# Altium project HardwareGesamt.PrjPcb
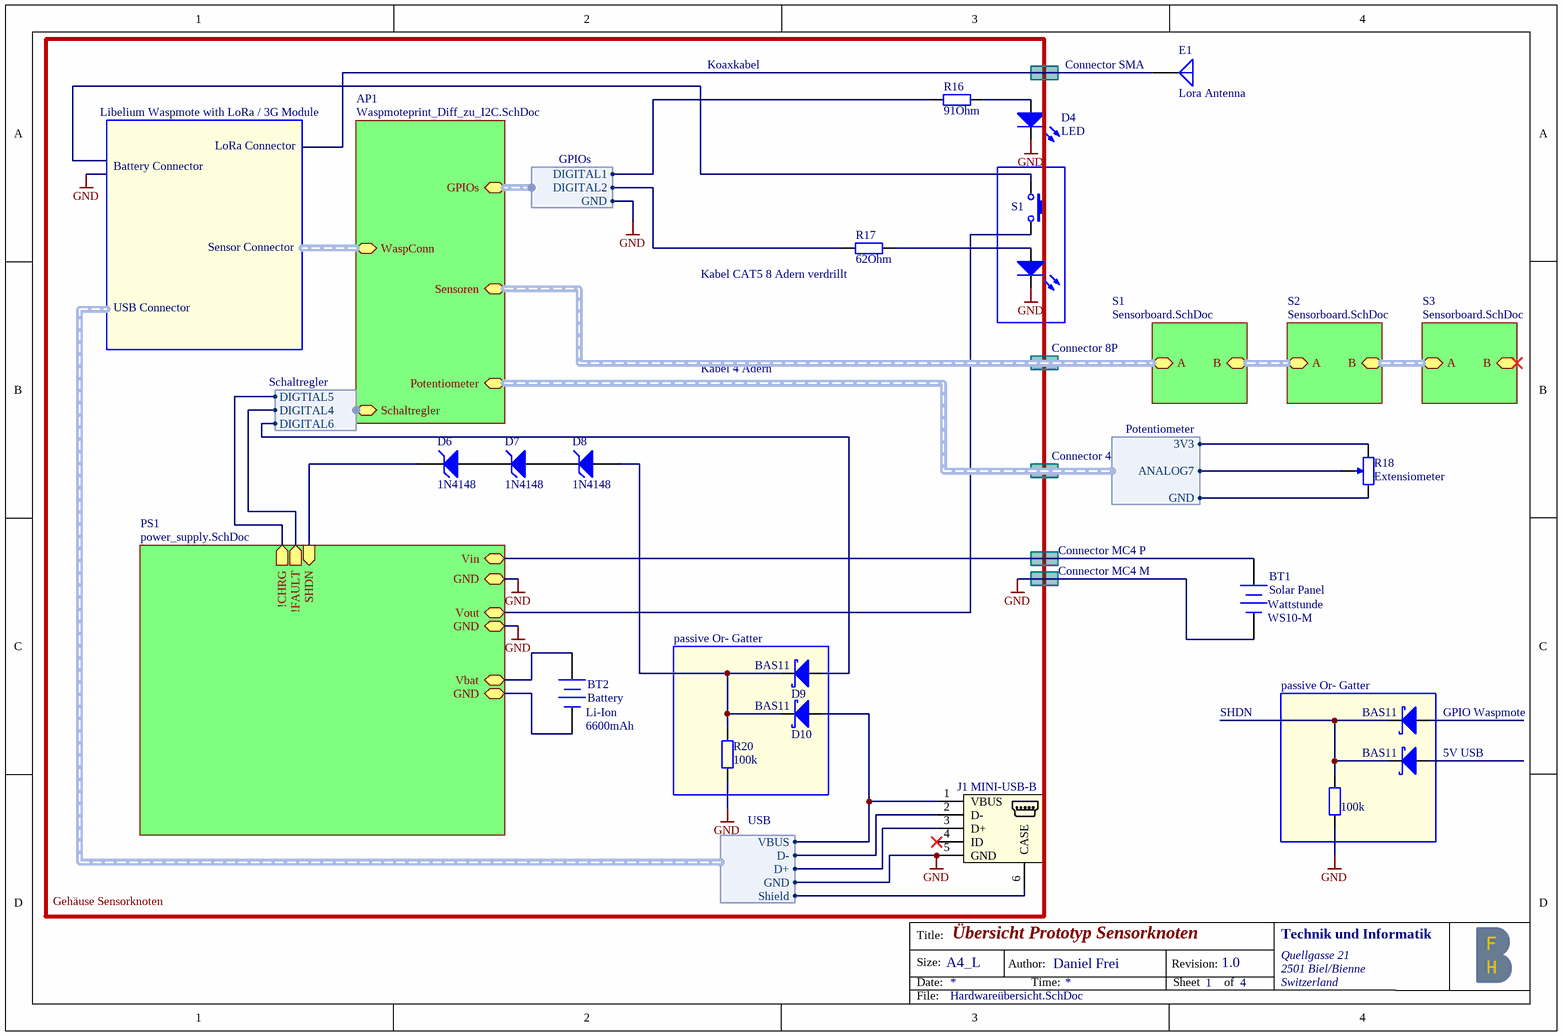
[diagram p0: Hardwareübersicht.SchDoc]
4 sheets, 216 parts. Net scope: hierarchical (ports join the sheet entries above them; power ports are global).
Sheets:
  Hardwareübersicht.SchDoc
    PS1 = power_supply.SchDoc
    AP1 = Waspmoteprint_Diff_zu_I2C.SchDoc
    S1 = Sensorboard.SchDoc
    S2 = Sensorboard.SchDoc
    S3 = Sensorboard.SchDoc

## Sheet Hardwareübersicht.SchDoc: Übersicht Prototyp Sensorknoten
size A4; Author: Daniel Frei; Organization: Technik und Informatik; Address1: Quellgasse 21; Address2: 2501 Biel/Bienne; Address3: Switzerland; Revision: 1.0; SheetNumber: 1; SheetTotal: 4; ProjectName: Rock Monitoring

### Parts
BT1  Solar Panel  value WS10-M  Manufacturer: Wattstunde  [BAT-2]
BT2  Battery  Type: Li-Ion  Nom. Capacity: 6600mAh
D4  LED
D5  LED  (value not drawn)
D6  1N4148
D7  1N4148
D8  1N4148
D9  BAS11
D10  BAS11
D11  BAS11
D12  BAS11
E1  Lora Antenna  [PIN1]
J1  MINI-USB-B
R16  91Ohm  [RESC1005[0402]X35]
R17  62Ohm  [RESC1005[0402]X35]
R18  Extensiometer  [BOURNS3296W]
R20  100k  [RESC1608[0603]X50]
R21  100k  [RESC1608[0603]X50]
S1  Switch  (value not drawn)

### Blocks framed on the sheet
passive Or- Gatter: D9 D10 R20
passive Or- Gatter: D11 D12 R21

### Sub-sheets
AP1 = Waspmoteprint_Diff_zu_I2C.SchDoc: GPIOs (harness GPIOs), Potentiometer (harness Potentiometer), Schaltregler (harness Schaltregler), Sensoren (harness Sensoren), WaspConn (harness WaspmoteConnector)
PS1 = power_supply.SchDoc: SHDN (in), !CHRG (out), !FAULT (out), Vin (bidir), GND (bidir), GND (bidir), Vout (bidir), GND (bidir), Vbat (bidir)
S1 = Sensorboard.SchDoc: A (harness Sensoren), B (harness Sensoren)
S2 = Sensorboard.SchDoc: A (harness Sensoren), B (harness Sensoren)
S3 = Sensorboard.SchDoc: A (harness Sensoren), B (harness Sensoren)

### Harnesses
USB: VBUS, D-, D+, GND, Shield
Potentiometer: 3V3, ANALOG7, GND
Schaltregler: DIGITAL6, DIGITAL4, DIGTIAL5
GPIOs: DIGITAL1, DIGITAL2, GND

### Nets
3V3: R18.3(CW) ; sheet AP1/Potentiometer.3V3
GND: BT1.2(-) BT2.2(-) D4.2(K) D5.2(K) J1.5(GND) R18.1(CCW) R20.1 R21.1 ; sheet PS1/GND, sheet PS1/GND, sheet PS1/GND, harness USB.GND, sheet AP1/Potentiometer.GND, sheet AP1/GPIOs.GND
Vin: BT1.1(+) ; sheet PS1/Vin
Analog7: R18.2(Wiper) ; sheet AP1/Potentiometer.ANALOG7
Digital1: R16.1 ; sheet AP1/GPIOs.DIGITAL1
Digital2: R17.1 ; sheet AP1/GPIOs.DIGITAL2
Digital4: sheet PS1/!FAULT, sheet AP1/Schaltregler.DIGITAL4
Digital5: sheet PS1/!CHRG, sheet AP1/Schaltregler.DIGTIAL5
Digital6: D9.2(A) ; sheet AP1/Schaltregler.DIGITAL6
NetBT2_1: BT2.1(+) S1.1 ; sheet PS1/Vout, sheet PS1/Vbat
NetD4_1: D4.1(A) R16.2
NetD5_1: D5.1(A) R17.2
NetD6_1: D6.1(A) D7.2(K)
NetD6_2: D6.2(K) ; sheet PS1/SHDN
NetD7_1: D7.1(A) D8.2(K)
NetD8_1: D8.1(A) D9.1(K) D10.1(K) R20.2
NetD10_2: D10.2(A) J1.1(VBUS) ; harness USB.VBUS
NetD11_1: D11.1(K) D12.1(K) R21.2
NetJ1_2: J1.2(D-) ; harness USB.D-
NetJ1_3: J1.3(D+) ; harness USB.D+
NetJ1_6: J1.6(CASE) ; harness USB.Shield

Not connected (* = marked no-connect by the designer): D11 2(A); D12 2(A); E1 1(A); J1 4(ID)*; S1 2

### Buses and harness runs
harness sheet AP1/Sensoren = sheet S1/A
harness sheet S1/B = sheet S2/A
harness sheet S2/B = sheet S3/A

### Notes on the sheet
- Libelium Waspmote with LoRa / 3G Module
- Koaxkabel
- Connector SMA
- Battery Connector
- LoRa Connector
- Sensor Connector
- USB Connector
- (near R17) Kabel CAT5 8 Adern verdrillt
- Kabel 4 Adern
- Connector 8P
- Connector 4P
- Connector MC4 P
- Connector MC4 M
- SHDN
- (near D11) GPIO Waspmote
- 5V USB
- Gehäuse Sensorknoten
- Title:
- Size:
- Date:
- A4_L
- Author:
- Time:
- Revision:
- Sheet
- of
- File:

### Library data of the parts
BT1 = Battery: Multicell Battery
BT2 = Battery: Nom. Voltage: 3.7V; Value: ICR18650H-1S3P
D4 = LED: Light Emitting Diode; Manufacturer: Dialight; Manufacturer Part. Nr.: 6071212310F; Color: green
D5 = LED: Light Emitting Diode; Color: green
D6-D8 = D Zener: Zener Diode
D9-D12 = D_SCHOTTKY: Schottky Diode; Value: BAS11
E1 = Antenna: Generic Antenna; Published: 24-Mar-1999; LatestRevisionDate: 17-Jul-2002; LatestRevisionNote: Re-released for DXP Platform.; PackageReference: PIN1; Publisher: Altium Limited
J1 = TYCO_1734035_1: Mini USB B Connector; Manufacturer Part. Nr.: 17-250021; Manufacturer: Conec
R16 R17 = R: Resistor; Modified_by: BEP1; Modified: 10.2008
R18 = POT2: Variable Resistor
R20 R21 = R: Resistor THT
S1 = SW_SPST_PB: Switch with Led; Manufacturer Part. Nr.: RP8200B2M1CEBLKBLKRED; Manufacturer: E-Switch

## Sheet power_supply.SchDoc: PowerSupply_Waspmote
size A4; Organization: Altium Limited; Address1: L3, 12a Rodborough Rd; Address2: Frenchs Forest; Address3: NSW; Address4: Australia 2086
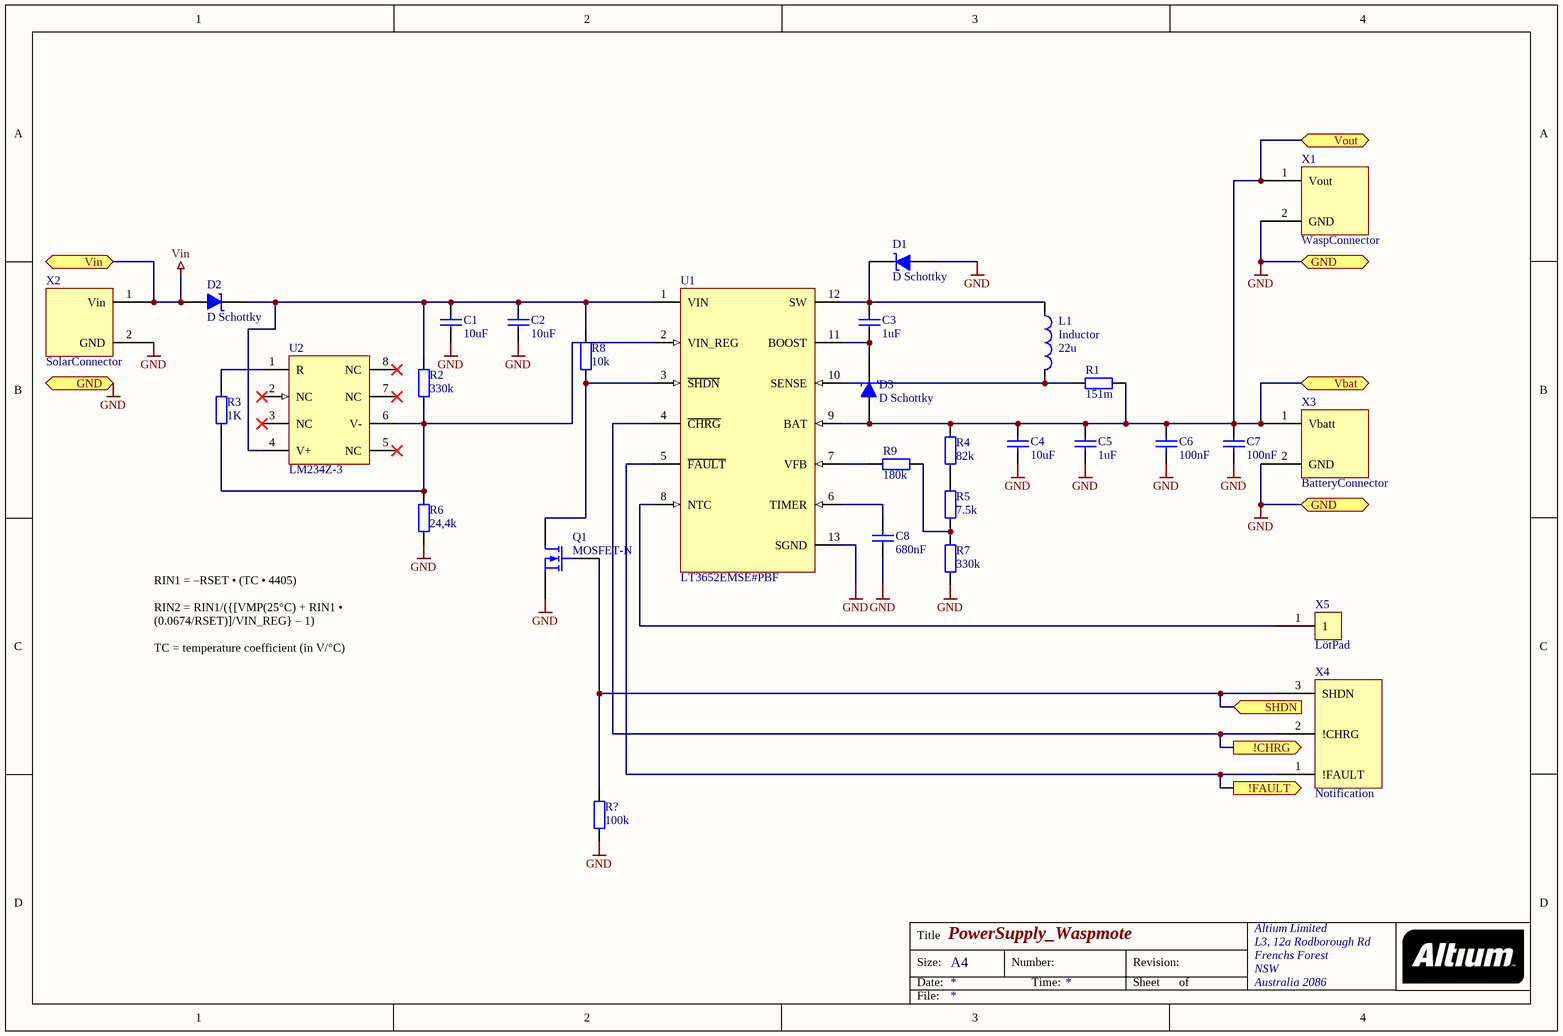
[diagram p1: power_supply.SchDoc]

### Parts
(Parts that share a designator on the sheet are numbered #1, #2 ... from top to bottom, then left to right.)
C1#1  10uF  [C1210]
C2#1  10uF  [C1210]
C3#1  1uF  [C1210]
C4#1  10uF  [C1210]
C5#1  1uF  [C1210]
C6#1  100nF  [0402]
C7#1  100nF  [0402]
C8#1  680nF  [0402]
D1  D Schottky  [SMB]
D2  D Schottky  [SMB]
D3  D Schottky  [SMB]
L1  Inductor  value 22u  [LMX131J]
Q1  MOSFET-N  [Sot-23]
R1#1  151m  [2510]
R2#1  330k  [0603]
R3#1  1K  [0603]
R4#1  82k  [0603]
R5#1  7.5k  [0603]
R6#1  24,4k  [0603]
R7#1  330k  [0402]
R8#1  10k  [0603]
R9#1  180k  [0402]
R?  100k  [RESC1608[0603]X50]
U1#1  LT3652EMSE#PBF  [LT-MSE-12-EDP_N]
U2  LM234Z-3  [SO-8]
X1#1  WaspConnector  [Wasp_Connector]
X2  SolarConnector  [Solar_Connector]
X3#1  BatteryConnector  [Battery_Connector]
X4#1  Notification  [NOTIFICATION_CONNECTOR]
X5#1  LötPad  [LötPad]

### Ports
!CHRG (out), !FAULT (out), GND (bidir), SHDN (in), Vbat (bidir), Vin (bidir), Vout (bidir)

### Nets
GND: C1#1.1 C2#1.1 C4#1.1 C5#1.1 C6#1.1 C7#1.1 C8#1.1 D1.1(A) Q1.3(S) R6#1.1 R7#1.1 R?.1 U1#1.13(SGND) X1#1.2(GND) X2.2(GND) X3#1.2(GND) ; port GND
Vin: D2.1(A) X2.1(Vin) ; port Vin
Digital4: U1#1.5(~{FAULT}) X4#1.1(!FAULT) ; port !FAULT
Digital5: U1#1.4(~{CHRG}) X4#1.2(!CHRG) ; port !CHRG
NetBT2_1: C4#1.2 C5#1.2 C6#1.2 C7#1.2 D3.1(A) R1#1.1 R4#1.2 U1#1.9(BAT) X1#1.1(Vout) X3#1.1(Vbatt) ; port Vout, port Vbat
NetC1#1_2: C1#1.2 C2#1.2 D2.2(K) R2#1.2 R8#1.2 U1#1.1(VIN) U2.4(V+)
NetC3#1_1: C3#1.1 D3.2(K) U1#1.11(BOOST)
NetC3#1_2: C3#1.2 D1.2(K) L1.1 U1#1.12(SW)
NetC8#1_2: C8#1.2 U1#1.6(TIMER)
NetD6_2: Q1.2(G) R?.2 X4#1.3(SHDN) ; port SHDN
NetL1_2: L1.2 R1#1.2 U1#1.10(SENSE)
NetQ1_1: Q1.1(D) R8#1.1 U1#1.3(~{SHDN})
NetR2#1_1: R2#1.1 R3#1.1 R6#1.2 U1#1.2(VIN_REG) U2.6(V-)
NetR3#1_2: R3#1.2 U2.1(R)
NetR4#1_1: R4#1.1 R5#1.2
NetR5#1_1: R5#1.1 R7#1.2 R9#1.1
NetR9#1_2: R9#1.2 U1#1.7(VFB)
NetU1#1_8: U1#1.8(NTC) X5#1.1

Not connected (* = marked no-connect by the designer): U2 2(NC)* 3(NC)* 5(NC)* 7(NC)* 8(NC)*

### Notes on the sheet
- RIN1 = –RSET • (TC • 4405)
  RIN2 = RIN1/({[VMP(25°C) + RIN1 • (0.0674/RSET)]/VIN_REG} – 1)
  TC = temperature coefficient (in V/°C)
- Title
- Size:
- Date:
- A4
- Number:
- Time:
- Revision:
- Sheet
- of
- File:

### Library data of the parts
C1#1 C2#1 C3#1 C4#1 C5#1 C6#1 C7#1 C8#1 = Cap Semi: Capacitor; Published: 8-Jun-2000; LatestRevisionDate: 29-May-2009; LatestRevisionNote: IPC-7351 Footprint Added.; PackageReference: C1206; Publisher: Altium Limited; PackageDescription: Chip Capacitor
  C1#1 C2#1 C4#1: Value: 10uF; Supplier 1: Farnell; Supplier 2: Digi-Key; Supplier Part Number 1: 1828859; Supplier Part Number 2: 490-1891-1-ND
  C3#1 C5#1: Value: 1uF; Supplier 1: Farnell; Supplier 2: Digi-Key; Supplier Part Number 2: 1276-3352-1-ND
  C6#1 C7#1: Value: 100nF; Supplier 1: Farnell; Supplier 2: Digi-Key; Supplier Part Number 1: 1844578; Supplier Part Number 2: 490-5920-1-ND
  C8#1: Value: 680nF
D1-D3 = D Schottky: Schottky Diode; Published: 8-Jun-2000; LatestRevisionDate: 17-Jul-2002; LatestRevisionNote: Re-released for DXP Platform.; PackageReference: SMB; Publisher: Altium Limited; PackageDescription: DO-214-AA/SMB; 2 C-Bend Leads; Body 5.3 x 3.6 mm, inc. leads (LxW); Code_JEDEC: DO-214-AA; Supplier Part Number 2: B340LB-FDICT-ND; Supplier 2: Digi-Key; Supplier Part Number 1: 1843684; Supplier 1: Farnell
Q1 = MOSFET-N: N-Channel MOSFET; Published: 8-Jun-2000; LatestRevisionDate: 17-Jul-2002; LatestRevisionNote: Re-released for DXP Platform.; PackageVersion: 1995/1996; PackageReference: E3; Publisher: Altium Limited; PackageDescription: TO, Flat Index; 3 In-Line, Axial Leads; Body Dia. 4.6mm; Lead Dia. 0.5 mm (max); Supplier Part Number 2: FDV301NCT-ND; Supplier 2: Digi-Key; Supplier 1: Farnell; Supplier Part Number 1: 9845011
R1#1 R2#1 R3#1 R4#1 R5#1 R6#1 R7#1 R8#1 R9#1 = Res2: Resistor; Published: 8-Jun-2000; LatestRevisionDate: 17-Jul-2002; LatestRevisionNote: Re-released for DXP Platform.; PackageReference: AXIAL-0.4; Publisher: Altium Limited; PackageDescription: Axial Device, Thru-Hole; 2 Leads; 0.4 in Pin Spacing
  R1#1: Value: 151m; Supplier 2: Digi-Key; Supplier Part Number 2: WSLG-.151CT-ND
  R2#1: Value: 330k
  R3#1: Value: 1K
  R4#1: Value: 82k; Supplier 2: Digi-Key; Supplier Part Number 2: 311-316KHRCT-ND; Supplier 1: Farnell; Supplier Part Number 1: 2303268
  R5#1: Value: 7.5k; Supplier Part Number 1: 2059603; Supplier 1: Farnell; Supplier 2: Digi-Key; Supplier Part Number 2: 311-1.2KGRCT-ND
  R6#1: Value: 24,4k
  R7#1: Value: 330k; Supplier 1: Farnell; Supplier 2: Digi-Key; Supplier Part NUmber 2: 541-1.18MLCT-ND; Supplier Part Number 1: 2316670
  R8#1: Value: 10k; Supplier 1: Farnell; Supplier 2: Digi-Key; Supplier Part NUmber 2: 311-10KGRCT-ND; Supplier Part Number 1: 1795343
  R9#1: Value: 180k; Supplier Part Number 2: 311-3.0JRCT-ND; Supplier 2: Digi-Key; Supplier 1: Farnell
R? = R: Resistor THT
U1#1 = LT3652EMSE#PBF: Battery Charger for Solar Power; Manufacturer: Linear Technology; Number of Outputs: 1; Vin Max(V): 32; Vin Min(V): 4.95; DatasheetVersion: Rev. D; PackageVersion: Rev. G, 05/2013; PackageReference: MSE-12-EDP; PackageDescription: 12-Pin Plastic MSOP, Exposed Die Pad, Body 4.039 x 3 mm, Pitch 0.65 mm; Supplier 1: Farnell; Supplier Part Number 1: 1839126; Supplier 2: Digi-Key; Supplier Part Number 2: LT3652EMSE#PBF-ND; Energy Source: Solar; RoHS: TRUE; Topology: Battery Charger; Mounting Technology: Surface Mount; PartNumber: LT3652EMSE#PBF; ComponentLink1Description: Manufacturer URL; ComponentLink1URL: http://www.linear.com/; ComponentLink2Description: Datasheet; ComponentLink2URL: http://cds.linear.com/docs/en/datasheet/3652fd.pdf; ComponentLink3Description: Package Specification; ComponentLink3URL: http://cds.linear.com/docs/en/packaging/05081666_G_MSE12.pdf; Value: LT3652EMSE#PBF
U2 = LM234Z-3: 3-Terminal Adjustable Current Source, 3-pin TO-92; Manufacturer: National Semiconductor; PackageTopMarking: NSXYTT*LM234*Z-3; PowerWise: N; CompType: MiscPower; High-Reliability: Y; DatasheetVersion: Mar-2005; PackageVersion: revG, Sep-2000; PackageReference: Z03A; PackageDescription: TO-92, Molded, 3 Lead; PartNumber: LM234Z-3; RoHS: N; PinCount: 3; Code_JEDEC: TO-226-AA; ComponentLink1Description: Manufacturer URL; ComponentLink1URL: http://www.national.com/; ComponentLink2Description: LM234 Datasheet; ComponentLink2URL: http://www.national.com/ds/LM/LM234.pdf; ComponentLink3Description: LM234 Web Page; ComponentLink3URL: http://www.national.com/pf/LM/LM234.html; ComponentLink4Description: Z03A Package Page; ComponentLink4URL: http://www.national.com/packaging/folders/z03a.html; Supplier part Number 1: 1467822; Supplier 1: Farnell; Supplier 2: Digikey; Supplier Part Number 2: 497-1549-1-ND; Value: LM234Z-3
X1#1 = WaspConnector: Connector; Supplier 1: Farnell; Supplier Part Number 1: 3705262; Supplier 2: Digi-Key; Supplier Part Number 2: 277-1150-ND
X2 = SolarConnector: Connector; Supplier Part Number 1: 3705262; Supplier Part Number 2: 277-1150-ND; Supplier 1: Farnell; Supplier 2: Digi-Key
X3#1 = BatteryConnector: Connector; Supplier 1: Farnell; Supplier 2: Digi-Key; Supplier Part Number 1: 3705262; Supplier Part Number 2: 277-1150-ND
X4#1 = Notification: Connector; Supplier 1: Farnell; Supplier 2: Digi-Key; Supplier Part Number 1: 3705274; Supplier Part Number 2: 277-1151-ND
X5#1 = LötPad: PAD
L1 = Inductor: Supplier 1: Farnell; Supplier 2: Digi-Key; Supplier Part Number 2: 478-7123-1-ND; Supplier Part Number 1: 2373880

## Sheet Waspmoteprint_Diff_zu_I2C.SchDoc: Übergangsprint Waspmote- rest. Hardware
size A4; Organization: Berner Fachhochschule; Address1: Technik und Informatik; Address2: Quellgasse 21; Address3: CH-2500 Biel/Bienne; Address4: Switzerland; Revision: 0.1; SheetNumber: 1; SheetTotal: 1; Date: 11.05.2016; Author: Daniel Frei; DrawnBy: Daniel Frei; ProjectName: Rock Monitoring
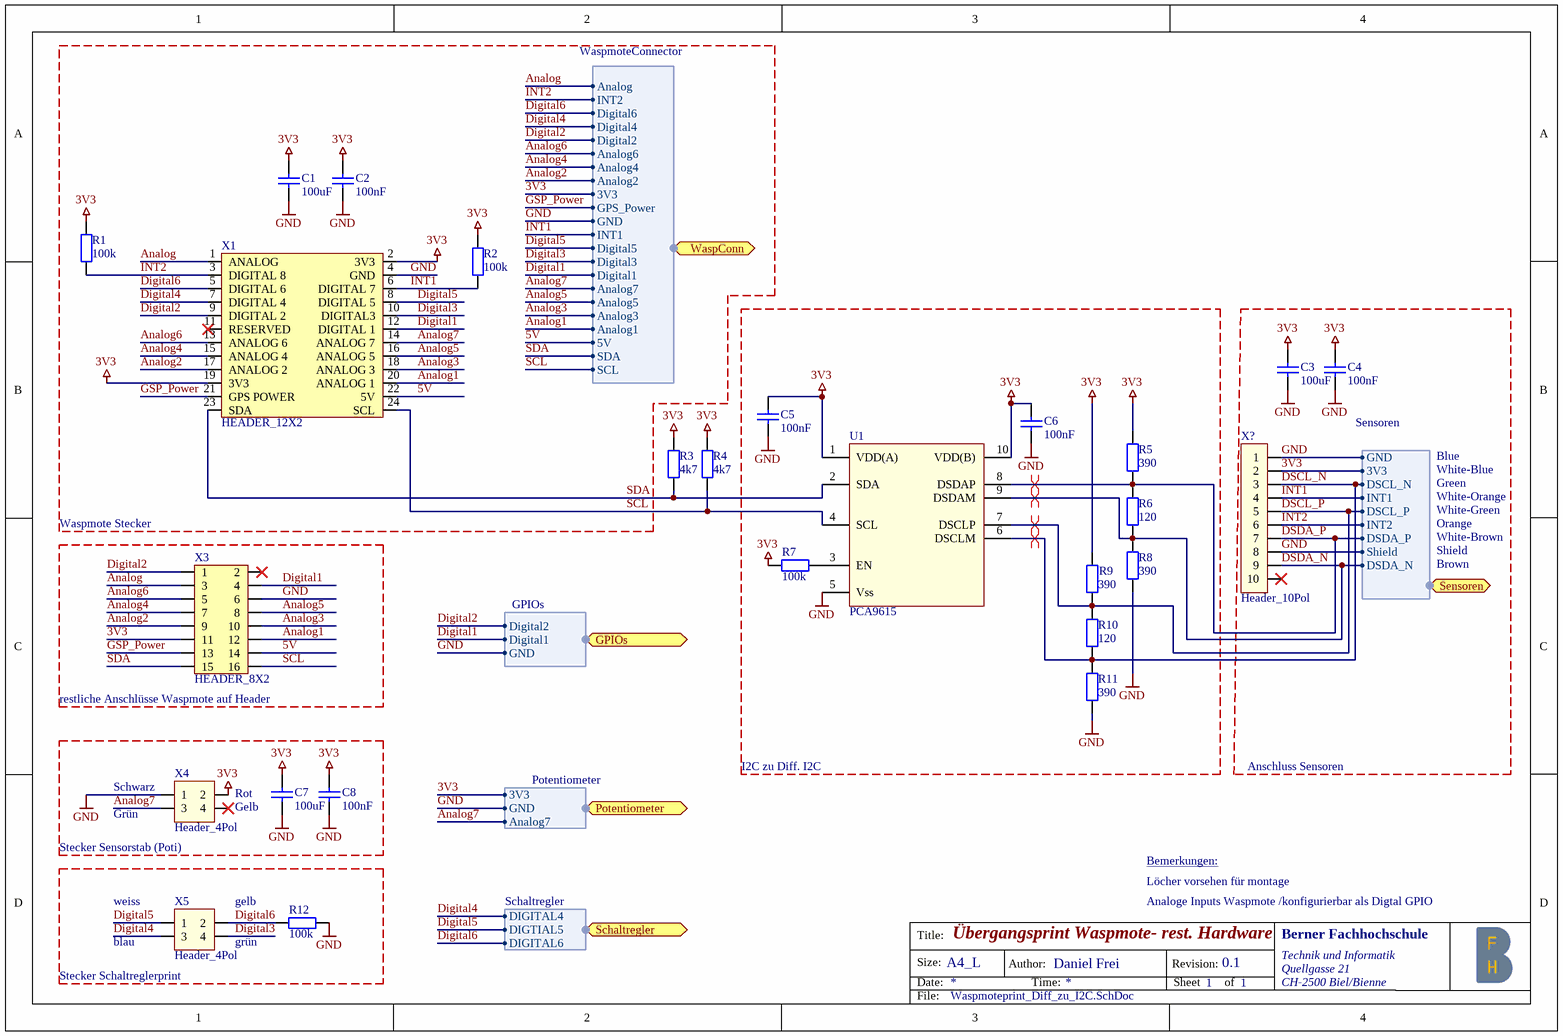
[diagram p2: Waspmoteprint_Diff_zu_I2C.SchDoc]

### Parts
(Parts that share a designator on the sheet are numbered #1, #2 ... from top to bottom, then left to right.)
C1#2  100uF  [CAPC3225[1210]X120]
C2#2  100nF  [CAPC1005[0402]X50]
C3#2  100uF  [CAPC3225[1210]X120]
C4#2  100nF  [CAPC1005[0402]X50]
C5#2  100nF  [CAPC1005[0402]X50]
C6#2  100nF  [CAPC1005[0402]X50]
C7#2  100uF  [CAPC3225[1210]X120]
C8#2  100nF  [CAPC1005[0402]X50]
R1#2  100k  [RESC1005[0402]X35]
R2#2  100k  [RESC1005[0402]X35]
R3#2  4k7  [RESC1005[0402]X35]
R4#2  4k7  [RESC1005[0402]X35]
R5#2  390  [RESC1005[0402]X35]
R6#2  120  [RESC1005[0402]X35]
R7#2  100k  [RESC1005[0402]X35]
R8#2  390  [RESC1005[0402]X35]
R9#2  390  [RESC1005[0402]X35]
R10  120  [RESC1005[0402]X35]
R11  390  [RESC1005[0402]X35]
R12  100k  [RESC1005[0402]X35]
U1#2  PCA9615  [TSSOP10]
X1#2  HEADER_12X2  [HDR2X12_V_M]
X3#2  HEADER_8X2  [HDR2X8_V_M]
X4#2  Header_4Pol  [Header_2mm_4Pol]
X5#2  Header_4Pol  [Header_2mm_4Pol]
X?  Header_10Pol  [Header_2mm_10Pol]

### Blocks framed on the sheet
Waspmote Stecker: C1#2 C2#2 R1#2 R2#2 X1#2
I2C zu Diff. I2C: C5#2 C6#2 R5#2 R6#2 R7#2 R8#2 R9#2 R10 R11 U1#2

### Ports
GPIOs (harness GPIOs), Potentiometer (harness Potentiometer), Schaltregler (harness Schaltregler), Sensoren (harness Sensoren), WaspConn (harness WaspmoteConnector)

### Harnesses
Sensoren: GND, 3V3, DSCL_N, INT1, DSCL_P, INT2, DSDA_P, Shield, DSDA_N
GPIOs: Digital2, Digital1, GND
Potentiometer: Analog7, GND, 3V3
WaspmoteConnector: Analog, INT2, Digital6, Digital4, Digital2, Analog6, Analog4, Analog2, 3V3, GPS_Power, GND, INT1, Digital5, Digital3, Digital1, Analog7, Analog5, Analog3, Analog1, 5V, SDA, SCL
Schaltregler: DIGITAL4, DIGITAL6, DIGTIAL5

### Nets
3V3: C1#2.2 C2#2.2 C3#2.2 C4#2.2 C5#2.2 C6#2.2 C7#2.2 C8#2.2 R1#2.2 R2#2.2 R3#2.2 R4#2.2 R5#2.2 R7#2.1 R9#2.2 U1#2.1(VDD(A)) U1#2.10(VDD(B)) X1#2.2(3V3) X1#2.19(3V3) X3#2.11 X4#2.2 X?.2 ; port Sensoren.3V3, port Potentiometer.3V3, port WaspConn.3V3
GND: C1#2.1 C2#2.1 C3#2.1 C4#2.1 C5#2.1 C6#2.1 C7#2.1 C8#2.1 R8#2.1 R11.1 R12.1 U1#2.5(Vss) X1#2.4(GND) X3#2.6 X4#2.1 X?.1 X?.8 ; port Sensoren.GND, port Sensoren.Shield, port GPIOs.GND, port Potentiometer.GND, port WaspConn.GND
5V: X1#2.22(5V) X3#2.14 ; port WaspConn.5V
Analog: X1#2.1(ANALOG) X3#2.3 ; port WaspConn.Analog
Analog1: X1#2.20(ANALOG_1) X3#2.12 ; port WaspConn.Analog1
Analog2: X1#2.17(ANALOG_2) X3#2.9 ; port WaspConn.Analog2
Analog3: X1#2.18(ANALOG_3) X3#2.10 ; port WaspConn.Analog3
Analog4: X1#2.15(ANALOG_4) X3#2.7 ; port WaspConn.Analog4
Analog5: X1#2.16(ANALOG_5) X3#2.8 ; port WaspConn.Analog5
Analog6: X1#2.13(ANALOG_6) X3#2.5 ; port WaspConn.Analog6
Analog7: X1#2.14(ANALOG_7) X4#2.3 ; port Potentiometer.Analog7, port WaspConn.Analog7
Digital1: X1#2.12(DIGITAL_1) X3#2.4 ; port GPIOs.Digital1, port WaspConn.Digital1
Digital2: X1#2.9(DIGITAL_2) X3#2.1 ; port GPIOs.Digital2, port WaspConn.Digital2
Digital3: X1#2.10(DIGITAL3) X5#2.4 ; port WaspConn.Digital3
Digital4: X1#2.7(DIGITAL_4) X5#2.3 ; port WaspConn.Digital4, port Schaltregler.DIGITAL4
Digital5: X1#2.8(DIGITAL_5) X5#2.1 ; port WaspConn.Digital5, port Schaltregler.DIGTIAL5
Digital6: R12.2 X1#2.5(DIGITAL_6) X5#2.2 ; port WaspConn.Digital6, port Schaltregler.DIGITAL6
DSCL_N: R10.1 R11.2 U1#2.6(DSCLM) X?.3 ; port Sensoren.DSCL_N
DSCL_P: R9#2.1 R10.2 U1#2.7(DSCLP) X?.5 ; port Sensoren.DSCL_P
DSDA_N: R6#2.1 R8#2.2 U1#2.9(DSDAM) X?.9 ; port Sensoren.DSDA_N
DSDA_P: R5#2.1 R6#2.2 U1#2.8(DSDAP) X?.7 ; port Sensoren.DSDA_P
GSP_Power: X1#2.21(GPS_POWER) X3#2.13 ; port WaspConn.GPS_Power
INT1: R2#2.1 X1#2.6(DIGITAL_7) X?.4 ; port Sensoren.INT1, port WaspConn.INT1
INT2: R1#2.1 X1#2.3(DIGITAL_8) X?.6 ; port Sensoren.INT2, port WaspConn.INT2
SCL: R4#2.1 U1#2.4(SCL) X1#2.24(SCL) X3#2.16 ; port WaspConn.SCL
SDA: R3#2.1 U1#2.2(SDA) X1#2.23(SDA) X3#2.15 ; port WaspConn.SDA
NetR7#2_2: R7#2.2 U1#2.3(EN)

Not connected (* = marked no-connect by the designer): X1#2 11(RESERVED)*; X3#2 2*; X4#2 4*; X? 10*

### Layout directives
differential pair: DSCL_N, DSCL_P, DSDA_N, DSDA_P

### Notes on the sheet
- Blue
- White-Blue
- White-Green
- White-Orange
- Green
- Shield
- White-Brown
- Brown
- Orange
- (near X3#2) restliche Anschlüsse Waspmote auf Header
- (near X4#2) Schwarz
- Anschluss Sensoren
- (near X4#2) Stecker Sensorstab (Poti)
- (near X4#2) Grün
- Rot
- Gelb
- (near X5#2) weiss
- gelb
- Analoge Inputs Waspmote /konfigurierbar als Digtal GPIO
- Löcher vorsehen für montage
- Bemerkungen:
- (near X5#2) Stecker Schaltreglerprint
- (near X5#2) blau
- grün
- Title:
- Size:
- Date:
- A4_L
- Author:
- Time:
- Revision:
- Sheet
- of
- File:

### Library data of the parts
C1#2 C3#2 C7#2 = C: Capacitor; Manufacturer: Murata; Manufacturer Part Number: GRM32ER61A107ME20L; Modified_by: BEP1; Modified: 10.2008; Type: *; Voltage: *; Value: 100uF; Supplier 1: Digi-Key; Supplier 2: Mouser; Supplier Part Number 1: 490-9969-1-ND; Supplier Part Number 2: 81-GRM32ER61A107ME0L
C2#2 C4#2 C5#2 C6#2 C8#2 = C: Capacitor; Modified_by: BEP1; Modified: 10.2008; Type: *; Voltage: *; Value: 100nF
R1#2 R2#2 R3#2 R4#2 R5#2 R6#2 R7#2 R8#2 R9#2 R10-R12 = R: Resistor; Modified_by: BEP1; Modified: 10.2008
  R1#2 R2#2 R7#2 R12: Value: 100k
  R3#2 R4#2: Value: 4k7
  R5#2 R8#2 R9#2 R11: Value: 390
  R6#2 R10: Value: 120
U1#2 = PCA9615: differential I2C-bus buffer; Manufacturer Part Number: PCA9615DPJ; Manufacturer: NXP; Value: PCA9615; Supplier Part Number 2: 771-PCA9615DPJ; Supplier Part Number 1: 568-11484-1-ND; Supplier 1: Digi-Key; Supplier 2: Mouser
X1#2 = HEADER_12X2: Header, 12-Pin, Dual row; Supplier 1: *; Supplier 2: *; Manufacturer: *; Manufacturer Part Number: *; Supplier Part Number 1: *; Supplier Part Number 2: *
X3#2 = HEADER_8X2: Header, 16-Pin, Dual row; Supplier 1: *; Supplier 2: *; Manufacturer: *; Manufacturer Part Number: *; Supplier Part Number 1: *; Supplier Part Number 2: *
X4#2 X5#2 = Header_Hirose_4: Header Hirose 4 Pol; Manufacturer Part Number: DF11-4DP-2DSA(24); Value: Header_4Pol; Supplier 1: Digi-Key; Manufacturer: Hirose; Supplier Part Number 1: H10229-ND; Supplier 2: Mouser; Supplier Part Number 2: 798-DF11-4DP-2DSA24
X? = Header_Hirose_10: Header Hirose 10 Pol; Manufacturer Part Number: DF11-10DP-2DSA(24); Value: Header_10Pol; Supplier 1: Digi-Key; Supplier Part Number 1: H10232-ND; Manufacturer: Hirose; Supplier 2: Mouser; Supplier Part Number 2: 798-DF11-10DP-2DSA24

## Sheet Sensorboard.SchDoc: Sensorboard
size A4; CheckedBy: <UPN>; Author: Daniel Frei; CompanyName: Berner Fachhochschule; DrawnBy: freid2; Organization: Technik und Informatik; Address1: Qellgasse 21; Address2: 2501 Biel/Bienne; DocumentNumber: <DOC NO>; Revision: 1.0; SheetNumber: 1; SheetTotal: 1; ProjectName: Sensorboard
Used 3 times, as channels S1, S2, S3. Parts and nets are listed once, with the designators drawn on the sheet.
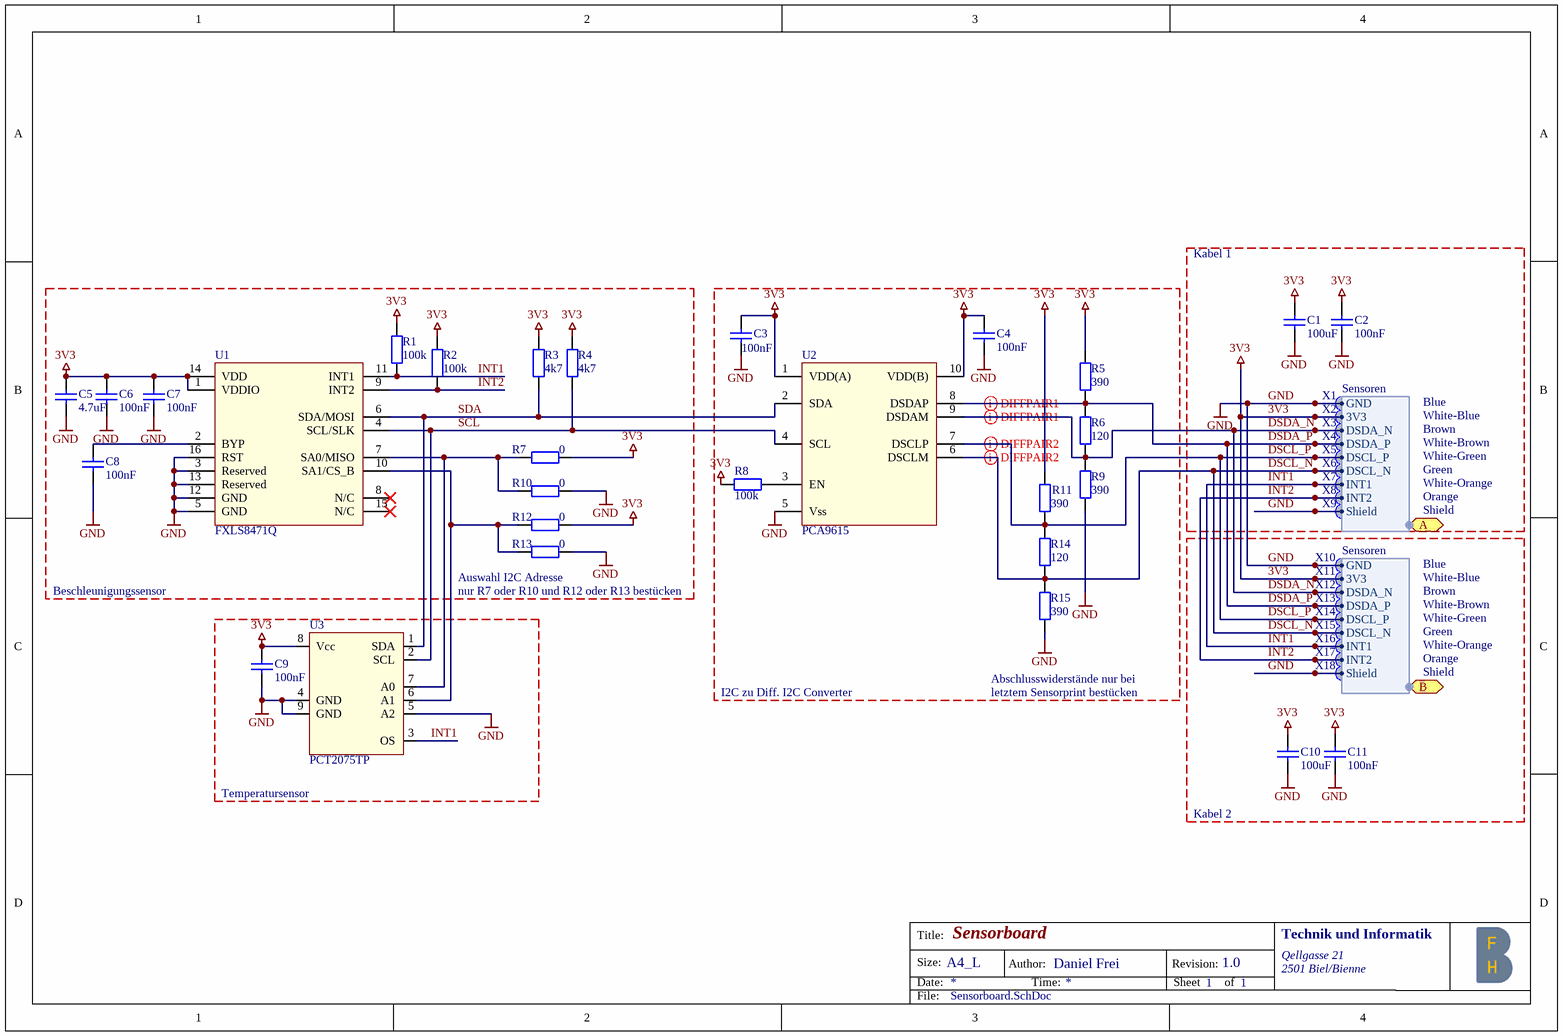
[diagram p3: Sensorboard.SchDoc]

### Parts
C1  100uF  [CAPC3225[1210]X120]
C2  100nF  [CAPC1005[0402]X50]
C3  100nF  [CAPC1005[0402]X50]
C4  100nF  [CAPC1005[0402]X50]
C5  4.7uF  [CAPC1608[0603]X80]
C6  100nF  [CAPC1005[0402]X50]
C7  100nF  [CAPC1005[0402]X50]
C8  100nF  [CAPC1005[0402]X50]
C9  100nF  [CAPC1005[0402]X50]
C10  100uF  [CAPC3225[1210]X120]
C11  100nF  [CAPC1005[0402]X50]
R1  100k  [RESC1005[0402]X35]
R2  100k  [RESC1005[0402]X35]
R3  4k7  [RESC1005[0402]X35]
R4  4k7  [RESC1005[0402]X35]
R5  390  [RESC1005[0402]X35]
R6  120  [RESC1005[0402]X35]
R7  0  [RESC1005[0402]X35]
R8  100k  [RESC1005[0402]X35]
R9  390  [RESC1005[0402]X35]
R10  0  [RESC1005[0402]X35]
R11  390  [RESC1005[0402]X35]
R12  0  [RESC1005[0402]X35]
R13  0  [RESC1005[0402]X35]
R14  120  [RESC1005[0402]X35]
R15  390  [RESC1005[0402]X35]
U1  FXLS8471Q  [16 LEAD QFN]
U2  PCA9615  [TSSOP10]
U3  PCT2075TP  [HWSON8]
X1  Loch  [Loch]  (value not drawn)
X2  Loch  [Loch]  (value not drawn)
X3  Loch  [Loch]  (value not drawn)
X4  Loch  [Loch]  (value not drawn)
X5  Loch  [Loch]  (value not drawn)
X6  Loch  [Loch]  (value not drawn)
X7  Loch  [Loch]  (value not drawn)
X8  Loch  [Loch]  (value not drawn)
X9  Loch  [Loch]  (value not drawn)
X10  Loch  [Loch]  (value not drawn)
X11  Loch  [Loch]  (value not drawn)
X12  Loch  [Loch]  (value not drawn)
X13  Loch  [Loch]  (value not drawn)
X14  Loch  [Loch]  (value not drawn)
X15  Loch  [Loch]  (value not drawn)
X16  Loch  [Loch]  (value not drawn)
X17  Loch  [Loch]  (value not drawn)
X18  Loch  [Loch]  (value not drawn)

### Blocks framed on the sheet
Temperatursensor: C9 U3

### Ports
A (harness Sensoren), B (harness Sensoren)

### Harnesses
Sensoren: 3V3, DSCL_N, DSCL_P, DSDA_N, DSDA_P, GND, INT1, INT2, Shield

### Nets
3V3: C1.2 C2.2 C3.2 C4.2 C5.2 C6.2 C7.2 C9.2 C10.2 C11.2 R1.2 R2.2 R3.2 R4.2 R5.2 R7.2 R8.1 R11.2 R12.2 U1.1(VDDIO) U1.14(VDD) U2.1(VDD(A)) U2.10(VDD(B)) U3.8(Vcc) X2.1 X11.1 ; port B.3V3, port A.3V3
GND: C1.1 C2.1 C3.1 C4.1 C5.1 C6.1 C7.1 C8.1 C9.1 C10.1 C11.1 R9.1 R10.2 R13.2 R15.1 U1.3(Reserved) U1.5(GND) U1.12(GND) U1.13(Reserved) U1.16(RST) U2.5(Vss) U3.4(GND) U3.5(A2) U3.9(GND) X1.1 X9.1 X10.1 X18.1 ; port B.GND, port B.Shield, port A.GND, port A.Shield
DSCL_N: R14.1 R15.2 U2.6(DSCLM) X6.1 X15.1 ; port B.DSCL_N, port A.DSCL_N
DSCL_P: R11.1 R14.2 U2.7(DSCLP) X5.1 X14.1 ; port B.DSCL_P, port A.DSCL_P
DSDA_N: R6.1 R9.2 U2.9(DSDAM) X3.1 X12.1 ; port B.DSDA_N, port A.DSDA_N
DSDA_P: R5.1 R6.2 U2.8(DSDAP) X4.1 X13.1 ; port B.DSDA_P, port A.DSDA_P
INT1: R1.1 U1.11(INT1) U3.3(OS) X7.1 X16.1 ; port B.INT1, port A.INT1
INT2: R2.1 U1.9(INT2) X8.1 X17.1 ; port B.INT2, port A.INT2
SCL: R4.1 U1.4(SCL/SLK) U2.4(SCL) U3.2(SCL)
SDA: R3.1 U1.6(SDA/MOSI) U2.2(SDA) U3.1(SDA)
NetC8_2: C8.2 U1.2(BYP)
NetR7_1: R7.1 R10.1 U1.7(SA0/MISO) U3.7(A0)
NetR8_2: R8.2 U2.3(EN)
NetR12_1: R12.1 R13.1 U1.10(SA1/CS_B) U3.6(A1)

Not connected (* = marked no-connect by the designer): U1 8(N/C)* 15(N/C)*

### Channels
S1: designators end in _S1
S2: designators end in _S2
S3: designators end in _S3

### Layout directives
differential pair: DSCL_N, DSCL_P, DSDA_N, DSDA_P

### Notes on the sheet
- Kabel 1
- Blue
- White-Blue
- White-Brown
- Brown
- Shield
- White-Green
- White-Orange
- Green
- Orange
- (near R13) Auswahl I2C Adresse
- Beschleunigungssensor
- (near R13) nur R7 oder R10 und R12 oder R13 bestücken
- I2C zu Diff. I2C Converter
- Abschlusswiderstände nur bei
- letztem Sensorprint bestücken
- Kabel 2
- Title:
- Size:
- Date:
- A4_L
- Author:
- Time:
- Revision:
- Sheet
- of
- File:

### Library data of the parts
C1 C10 = C: as C1#2 on sheet Waspmoteprint_Diff_zu_I2C; Modified: 10.2008; Type: *; Voltage: *; Value: 100uF; Supplier 1: Digi-Key; Supplier 2: Mouser; Supplier Part Number 1: 490-9969-1-ND; Supplier Part Number 2: 81-GRM32ER61A107ME0L
C2-C4 C6-C9 C11 = C: Capacitor; Modified_by: BEP1; Modified: 10.2008; Type: *; Voltage: *; Value: 100nF
C5 = C: Capacitor; Manufacturer: Murata; Manufacturer Part Number: GRM188R61A475KE15D; Modified_by: BEP1; Voltage: 10V; Modified: 10.2008; Type: *; Value: 4.7uF; Supplier 1: Digi-Key; Supplier 2: Mouser; Supplier Part Number 1: 490-10477-1-ND; Supplier Part Number 2: 81-GRM188R61A475KE5D
R1-R6 R8 R9 R11 R14 R15 = R: Resistor; Modified_by: BEP1; Modified: 10.2008
  R1 R2 R8: Value: 100k
  R3 R4: Value: 4k7
  R5 R9 R11 R15: Value: 390
  R6 R14: Value: 120
R7 R10 R12 R13 = R: Resistor; Manufacturer: Panasonic; Manufacturer Part Number: ERJ-2GE0R00X; Modified_by: BEP1; Modified: 10.2008; Value: 0; Supplier 1: Digi-Key; Supplier 2: Mouser; Supplier Part Number 1: P0.0JCT-ND; Supplier Part Number 2: 667-ERJ-2GE0R00X
U1 = FXLS8471Q: 3-Axis,  Linear Accelerometer; Manufacturer Part Number: FXLS8471QR1; Manufacturer: NXP; Value: FXLS8471Q; Supplier Part Number 2: 841-FXLS8471QR1; Supplier Part Number 1: FXLS8471QR1CT-ND; Supplier 2: Mouser; Supplier 1: Digi-Key
U2 = PCA9615: as U1#2 on sheet Waspmoteprint_Diff_zu_I2C; Value: PCA9615; Supplier Part Number 2: 771-PCA9615DPJ; Supplier Part Number 1: 568-11484-1-ND; Supplier 1: Digi-Key; Supplier 2: Mouser
U3 = PCT2075TP: Temperature_Sensor; Manufacturer: NXP; Manufacturer Part Number: PCT2075TP,147; Value: PCT2075TP; Supplier 1: Digi-Key; Supplier 2: Mouser; Supplier Part Number 1: 568-10220-1-ND; Supplier Part Number 2: 771-PCT2075TP147
X1-X18 = Loch: Loch in Print um Kabel einzulöten

## Nets that join several sheets
3V3: Hardwareübersicht (R18.3), Waspmoteprint_Diff_zu_I2C (22 pins), S1 (26 pins), S2 (26 pins), S3 (26 pins)
GND: Hardwareübersicht (8 pins), power_supply (16 pins), Waspmoteprint_Diff_zu_I2C (17 pins), S1 (28 pins), S2 (28 pins), S3 (28 pins)
Vin: Hardwareübersicht (BT1.1), power_supply (D2.1 X2.1)
Analog7: Hardwareübersicht (R18.2), Waspmoteprint_Diff_zu_I2C (X1#2.14 X4#2.3)
Digital1: Hardwareübersicht (R16.1), Waspmoteprint_Diff_zu_I2C (X1#2.12 X3#2.4)
Digital2: Hardwareübersicht (R17.1), Waspmoteprint_Diff_zu_I2C (X1#2.9 X3#2.1)
Digital4: power_supply (U1#1.5 X4#1.1), Waspmoteprint_Diff_zu_I2C (X1#2.7 X5#2.3)
Digital5: power_supply (U1#1.4 X4#1.2), Waspmoteprint_Diff_zu_I2C (X1#2.8 X5#2.1)
Digital6: Hardwareübersicht (D9.2), Waspmoteprint_Diff_zu_I2C (R12.2 X1#2.5 X5#2.2)
DSCL_N: Waspmoteprint_Diff_zu_I2C (R10.1 R11.2 U1#2.6 X?.3), S1 (5 pins), S2 (5 pins), S3 (5 pins)
DSCL_P: Waspmoteprint_Diff_zu_I2C (R9#2.1 R10.2 U1#2.7 X?.5), S1 (5 pins), S2 (5 pins), S3 (5 pins)
DSDA_N: Waspmoteprint_Diff_zu_I2C (R6#2.1 R8#2.2 U1#2.9 X?.9), S1 (5 pins), S2 (5 pins), S3 (5 pins)
DSDA_P: Waspmoteprint_Diff_zu_I2C (R5#2.1 R6#2.2 U1#2.8 X?.7), S1 (5 pins), S2 (5 pins), S3 (5 pins)
INT1: Waspmoteprint_Diff_zu_I2C (R2#2.1 X1#2.6 X?.4), S1 (5 pins), S2 (5 pins), S3 (5 pins)
INT2: Waspmoteprint_Diff_zu_I2C (R1#2.1 X1#2.3 X?.6), S1 (R2_S1.1 U1_S1.9 X8_S1.1 X17_S1.1), S2 (R2_S2.1 U1_S2.9 X8_S2.1 X17_S2.1), S3 (R2_S3.1 U1_S3.9 X8_S3.1 X17_S3.1)
NetBT2_1: Hardwareübersicht (BT2.1 S1.1), power_supply (10 pins)
NetD6_2: Hardwareübersicht (D6.2), power_supply (Q1.2 R?.2 X4#1.3)